# Altium schematic sheet AM-ExternalMemory.SchDoc
size A
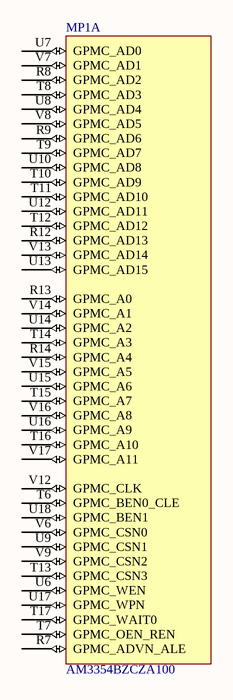
[diagram p0: AM-ExternalMemory.SchDoc]

## Parts
MP1  AM3354BZCZA100  [TI-ZCZ324]  (part A of 9)

## Nets

Not connected (* = marked no-connect by the designer): MP1 R7(GPMC_ADVN_ALE) R8(GPMC_AD2) R9(GPMC_AD6) R12(GPMC_AD13) R13(GPMC_A0) R14(GPMC_A4) T6(GPMC_BEN0_CLE) T7(GPMC_OEN_REN) T8(GPMC_AD3) T9(GPMC_AD7) T10(GPMC_AD9) T11(GPMC_AD10) T12(GPMC_AD12) T13(GPMC_CSN3) T14(GPMC_A3) T15(GPMC_A7) T16(GPMC_A10) T17(GPMC_WAIT0) U6(GPMC_WEN) U7(GPMC_AD0) U8(GPMC_AD4) U9(GPMC_CSN1) U10(GPMC_AD8) U12(GPMC_AD11) U13(GPMC_AD15) U14(GPMC_A2) U15(GPMC_A6) U16(GPMC_A9) U17(GPMC_WPN) U18(GPMC_BEN1) V6(GPMC_CSN0) V7(GPMC_AD1) V8(GPMC_AD5) V9(GPMC_CSN2) V12(GPMC_CLK) V13(GPMC_AD14) V14(GPMC_A1) V15(GPMC_A5) V16(GPMC_A8) V17(GPMC_A11)

## Library data of the parts
MP1 = CMP-0547-00017-2: Sitara ARM Cortex-A8 32-Bit RISC Microprocessor, 1 GHz, SGX530 3D Graphics Engine, Programmable Real-Time Unit and Industrial Communication Subsystem (PRU-ICSS), -40 to 105 degC, 324-pin NFBGA (ZCZ), Green (RoHS & no Sb/Br); Manufacturer: Texas Instruments; eQEP: 3; CAN: 2; UART (SCI): 6; ComponentLink2Description: Datasheet; Mounting Technology: Surface Mount; ComponentLink3Description: Package Specification; Operating Temperature: -40 to 105 degC; PackageReference: ZCZ324; ComponentLink3URL: http://www.ti.com/lit/ds/symlink/am3352.pdf; ARM CPU: Cortex-A8; SPI: 2; ComponentLink2URL: http://www.ti.com/lit/ds/symlink/am3352.pdf; ComponentLink1URL: http://www.ti.com/; PackageVersion: 4211570/A; DatasheetVersion: SPRS717F; eCAP: 3; ComponentLink1Description: Manufacturer URL; PartNumber: AM3354BZCZA100; I2C: 3; PackageDescription: 324-Pin Plastic Ball Grid Array, Body 15 x 15 mm, Pitch 0.8 mm